# EasyEDA schematic Easy_EDA-TopHat_2021-02-20.json
TITLE: TopHat; REV: 1.0; Date: 2021-01-05; Sheet: 1/1; Drawn By: Henrik Östman; Company: Liquidbytes.se
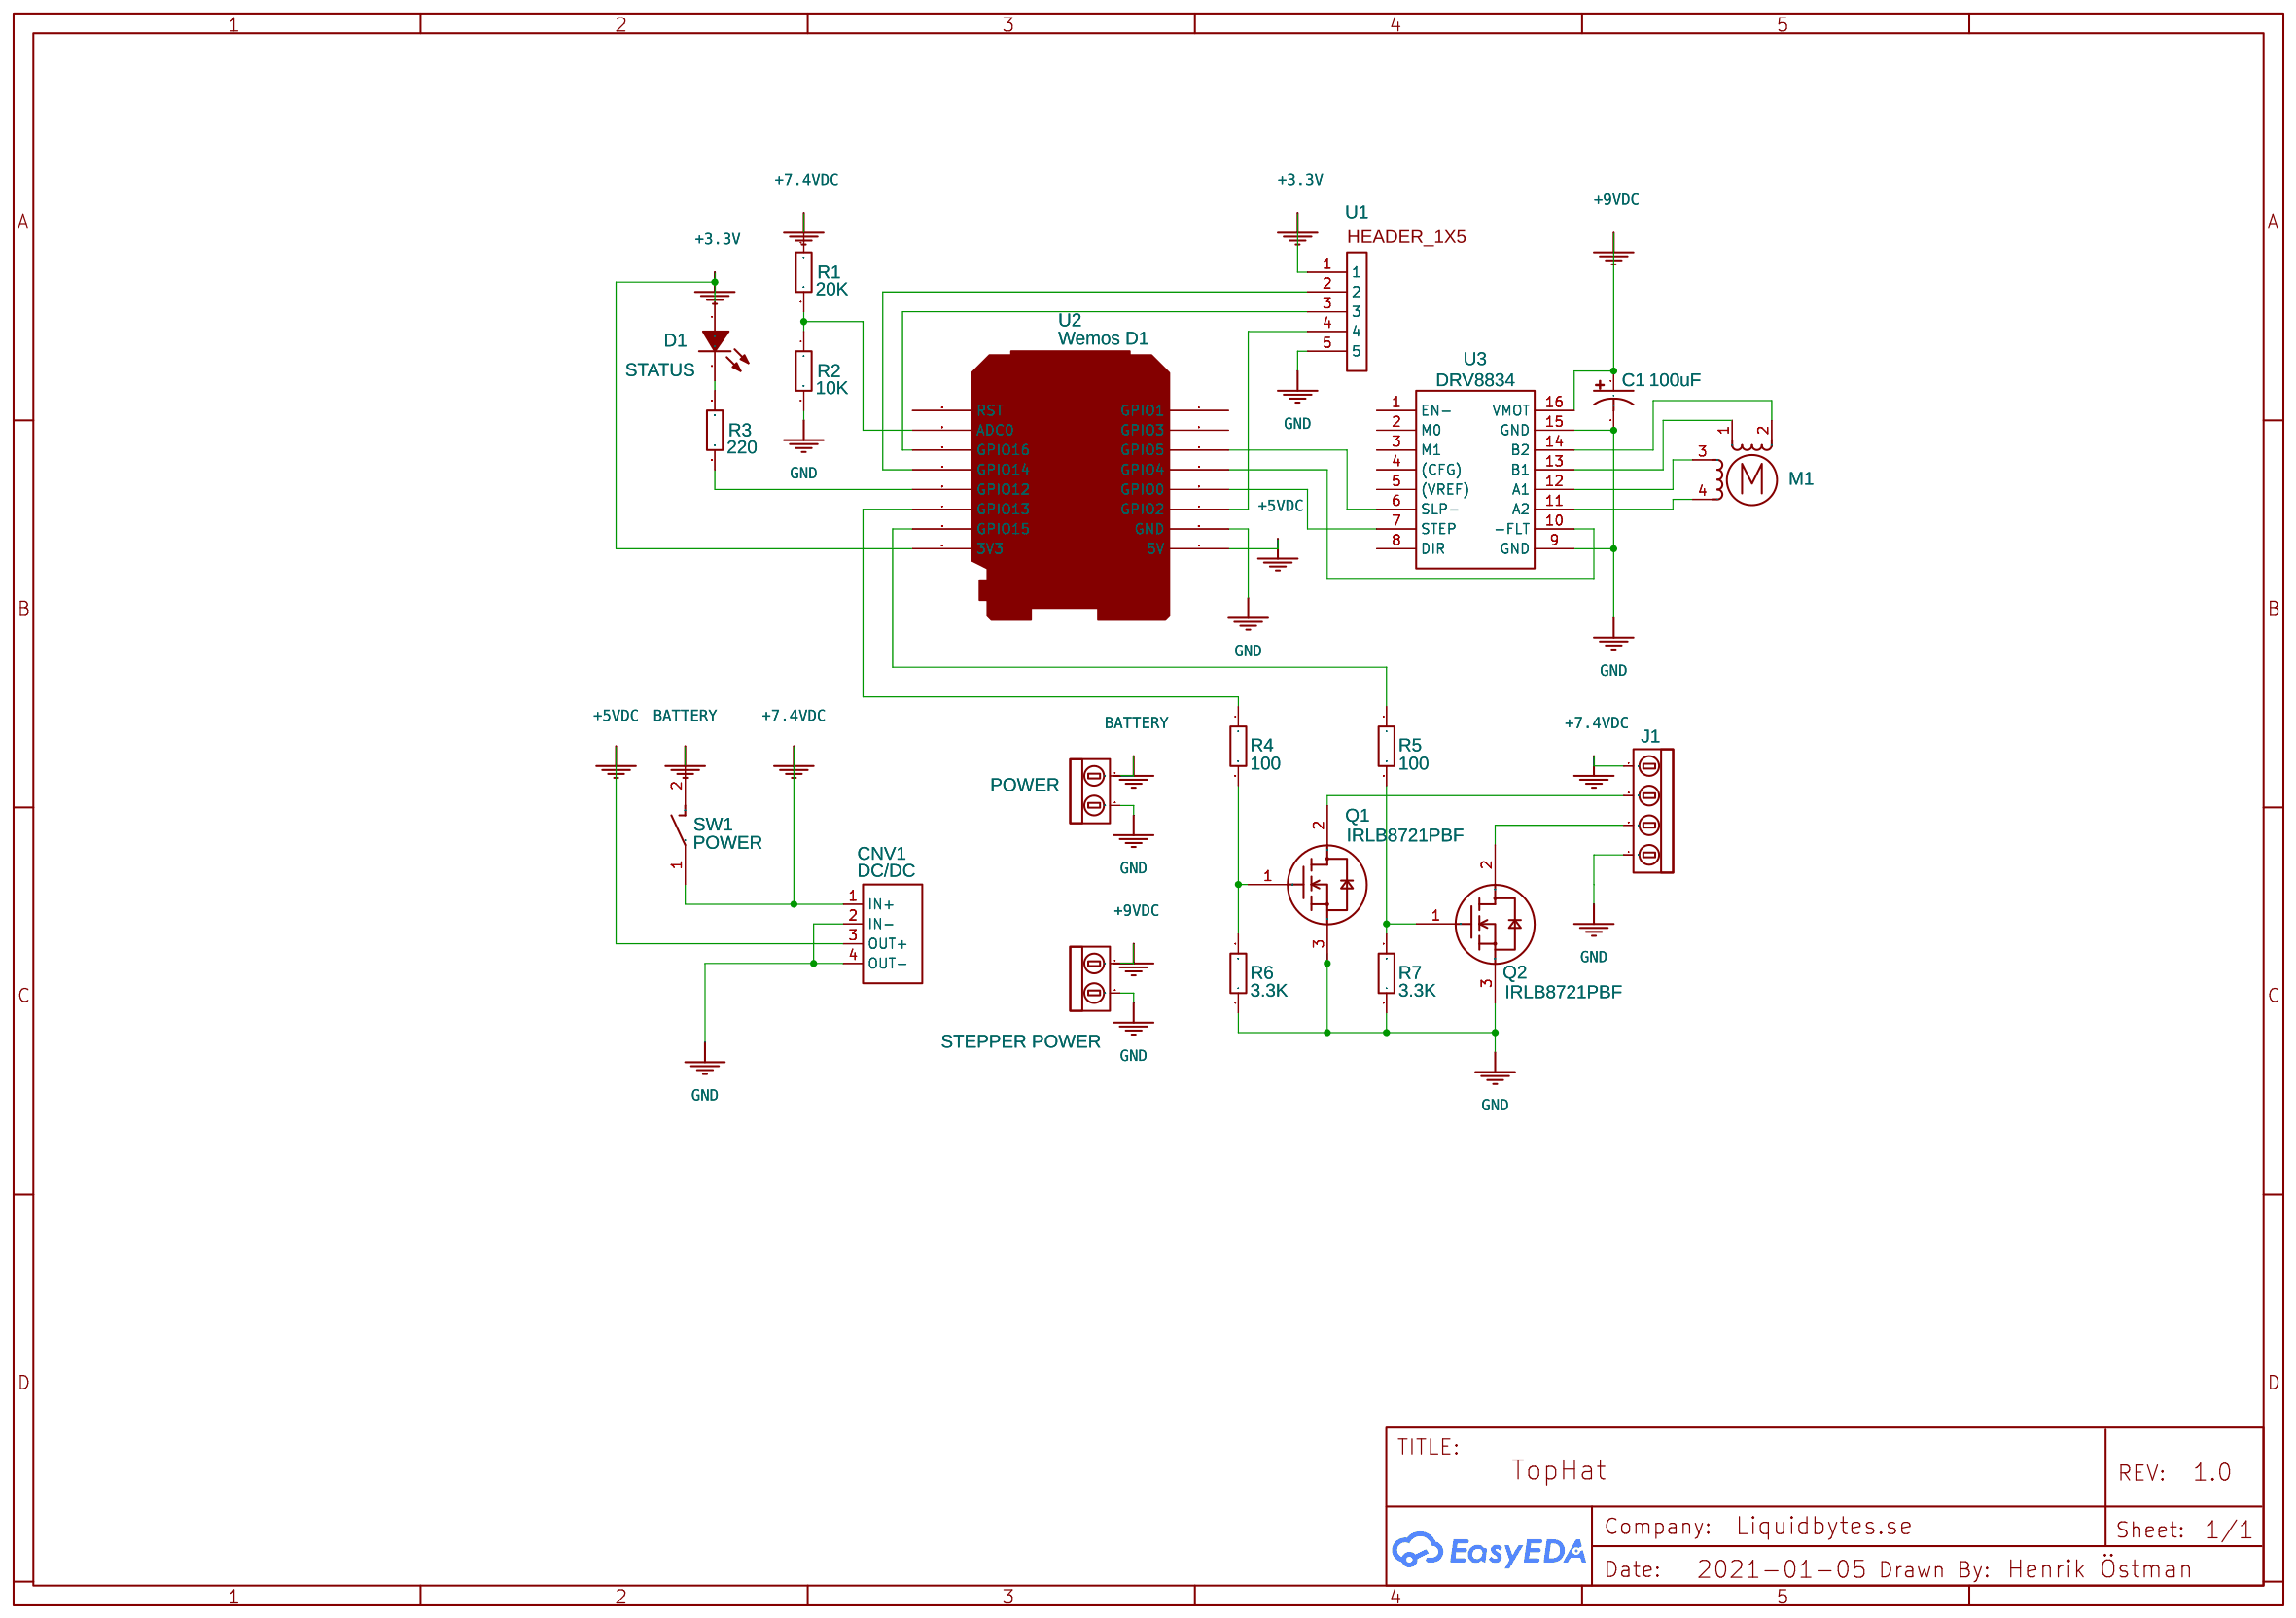
[diagram p0: schematic sheet]

## Parts
C1  100uF  [CPOL-RADIAL-100UF-25V]
CNV1  DC/DC  [BUCKCONVERTER2]
D1  STATUS  [LED-3MM/2.54]
M1  Stepper_Motor_bipolar  [CONN-TH_4P-P2.50_XH-4A]
NO1  POWER  [PTR AKZ350/2-5.08-V 2 PIN]
NO2  J1  [PTR AKZ350/4-5.08-V 4 PIN]
NO3  STEPPER POWER  [PTR AKZ350/2-5.08-V 2 PIN]
Q1  IRLB8721PBF  [TO-220-3_L10.0-W4.5-P2.54-L]
Q2  IRLB8721PBF  [TO-220-3_L10.0-W4.5-P2.54-L]
R1  20K  [AXIAL-6.5X2.3(1/4W)]
R2  10K  [AXIAL-6.5X2.3(1/4W)]
R3  220  [AXIAL-6.5X2.3(1/4W)]
R4  100  [AXIAL-6.5X2.3(1/4W)]
R5  100  [AXIAL-6.5X2.3(1/4W)]
R6  3.3K  [AXIAL-6.5X2.3(1/4W)]
R7  3.3K  [AXIAL-6.5X2.3(1/4W)]
SW1  POWER  [SWITCH]
U1  HEADER 1x5  [M1X5]
U2  Wemos D1  [WEMOS_D1_MINI_V2.3.0]
U3  DRV8834  [DRV8834 STEPPER MOTOR DRIVER CARRIER]

## Library data of the parts
C1 = 100UF-25V-20%(PTH): CAP-08439; Contributor: SparkFun
CNV1 = Converter: Supplier Part: DSN_MINI_360; Contributor: tomi.inkeroinen
D1 = -: Supplier: LCSC; Manufacturer: EVERLIGHT; Manufacturer Part: 204-10UYD/S530-A3; Contributor: LCSC; Supplier Part: C142312
M1 = Stepper_Motor_bipolar: Contributor: KiCAD; license: https://www.gnu.org/licenses/lgpl-2.1.html
NO1 NO3 = SCREWTERMINAL 1.50 MM² PTR AKZ350/2-5.08-V: Manufacturer Part: 50350080001E; link: https://www.conrad.com/p/ptr-akz3508-508-v-screw-terminal-150-mm-number-of-pins-2-green-1-pcs-732182; Contributor: smart-home.rocks; Supplier Part: 731986; Supplier: Conrad
NO2 = SCREWTERMINAL 1.50 MM² PTR AKZ350/4-5.08-V: Manufacturer Part: 50350080001E; link: https://www.conrad.com/p/ptr-akz3508-508-v-screw-terminal-150-mm-number-of-pins-8-green-1-pcs-732182; Contributor: smart-home.rocks; Supplier Part: 732129; Supplier: Conrad
Q1 Q2 = -: Supplier: LCSC; Manufacturer: Infineon; Contributor: LCSC; Supplier Part: C153222
R1-R7 = 10k Resistor THT (C119347): Supplier: LCSC; Supplier Part: C119347; Manufacturer: Chian Chia Elec; Contributor: LCSC
SW1 = Switch: Contributor: dierly
U1 = HEADER 1x5: Contributor: HAIIM
U2 = Wemos D1: Manufacturer: Wemos; Contributor: Fitri nurasiah
U3 = DRV8834: Contributor: overman91

## Nets
+3.3V: D1.1(A) U1.1 U2.3V3
+5VDC: CNV1.3(OUT+) U2.5V
+7.4VDC: CNV1.1(IN+) NO2.1 R1.1 SW1.1
+9VDC: C1.1(+) NO3.1 U3.16(VMOT)
GND: C1.2(-) CNV1.2(IN-) CNV1.4(OUT-) NO1.2 NO2.4 NO3.2 Q1.3(S) Q2.3(S) R2.2 R6.1 R7.1 U1.5 U2.GND U3.9(GND) U3.15(GND)
BATTERY: NO1.1 SW1.2
Net-(D1-2): D1.2(K) R3.2
Net-(M1-1): M1.1 U3.13(B1)
Net-(M1-2): M1.2 U3.14(B2)
Net-(M1-3): M1.3 U3.12(A1)
Net-(M1-4): M1.4 U3.11(A2)
Net-(NO2-2): NO2.2 Q1.2(D)
Net-(NO2-3): NO2.3 Q2.2(D)
Net-(Q1-1): Q1.1(G) R4.2 R6.2
Net-(Q2-1): Q2.1(G) R5.2 R7.2
Net-(R1-2): R1.2 R2.1 U2.A0(ADC0)
Net-(R3-1): R3.1 U2.D6(GPIO12)
Net-(R4-1): R4.1 U2.D7(GPIO13)
Net-(R5-1): R5.1 U2.D8(GPIO15)
Net-(U1-2): U1.2 U2.D2(GPIO14) U3.10(-FLT)
Net-(U1-3): U1.3 U2.D0(GPIO16)
Net-(U1-4): U1.4 U2.D4(GPIO2)
Net-(U2-D1): U2.D1(GPIO5) U3.6(SLP-)
Net-(U2-D3): U2.D3(GPIO0) U3.7(STEP)

Not connected (* = marked no-connect by the designer): U2 RST RX(GPIO3) TX(GPIO1); U3 1(EN-) 2(M0) 3(M1) 4((CFG)) 5((VREF)) 8(DIR)
